# EAGLE design LED_board (EAGLE 9.6.2)
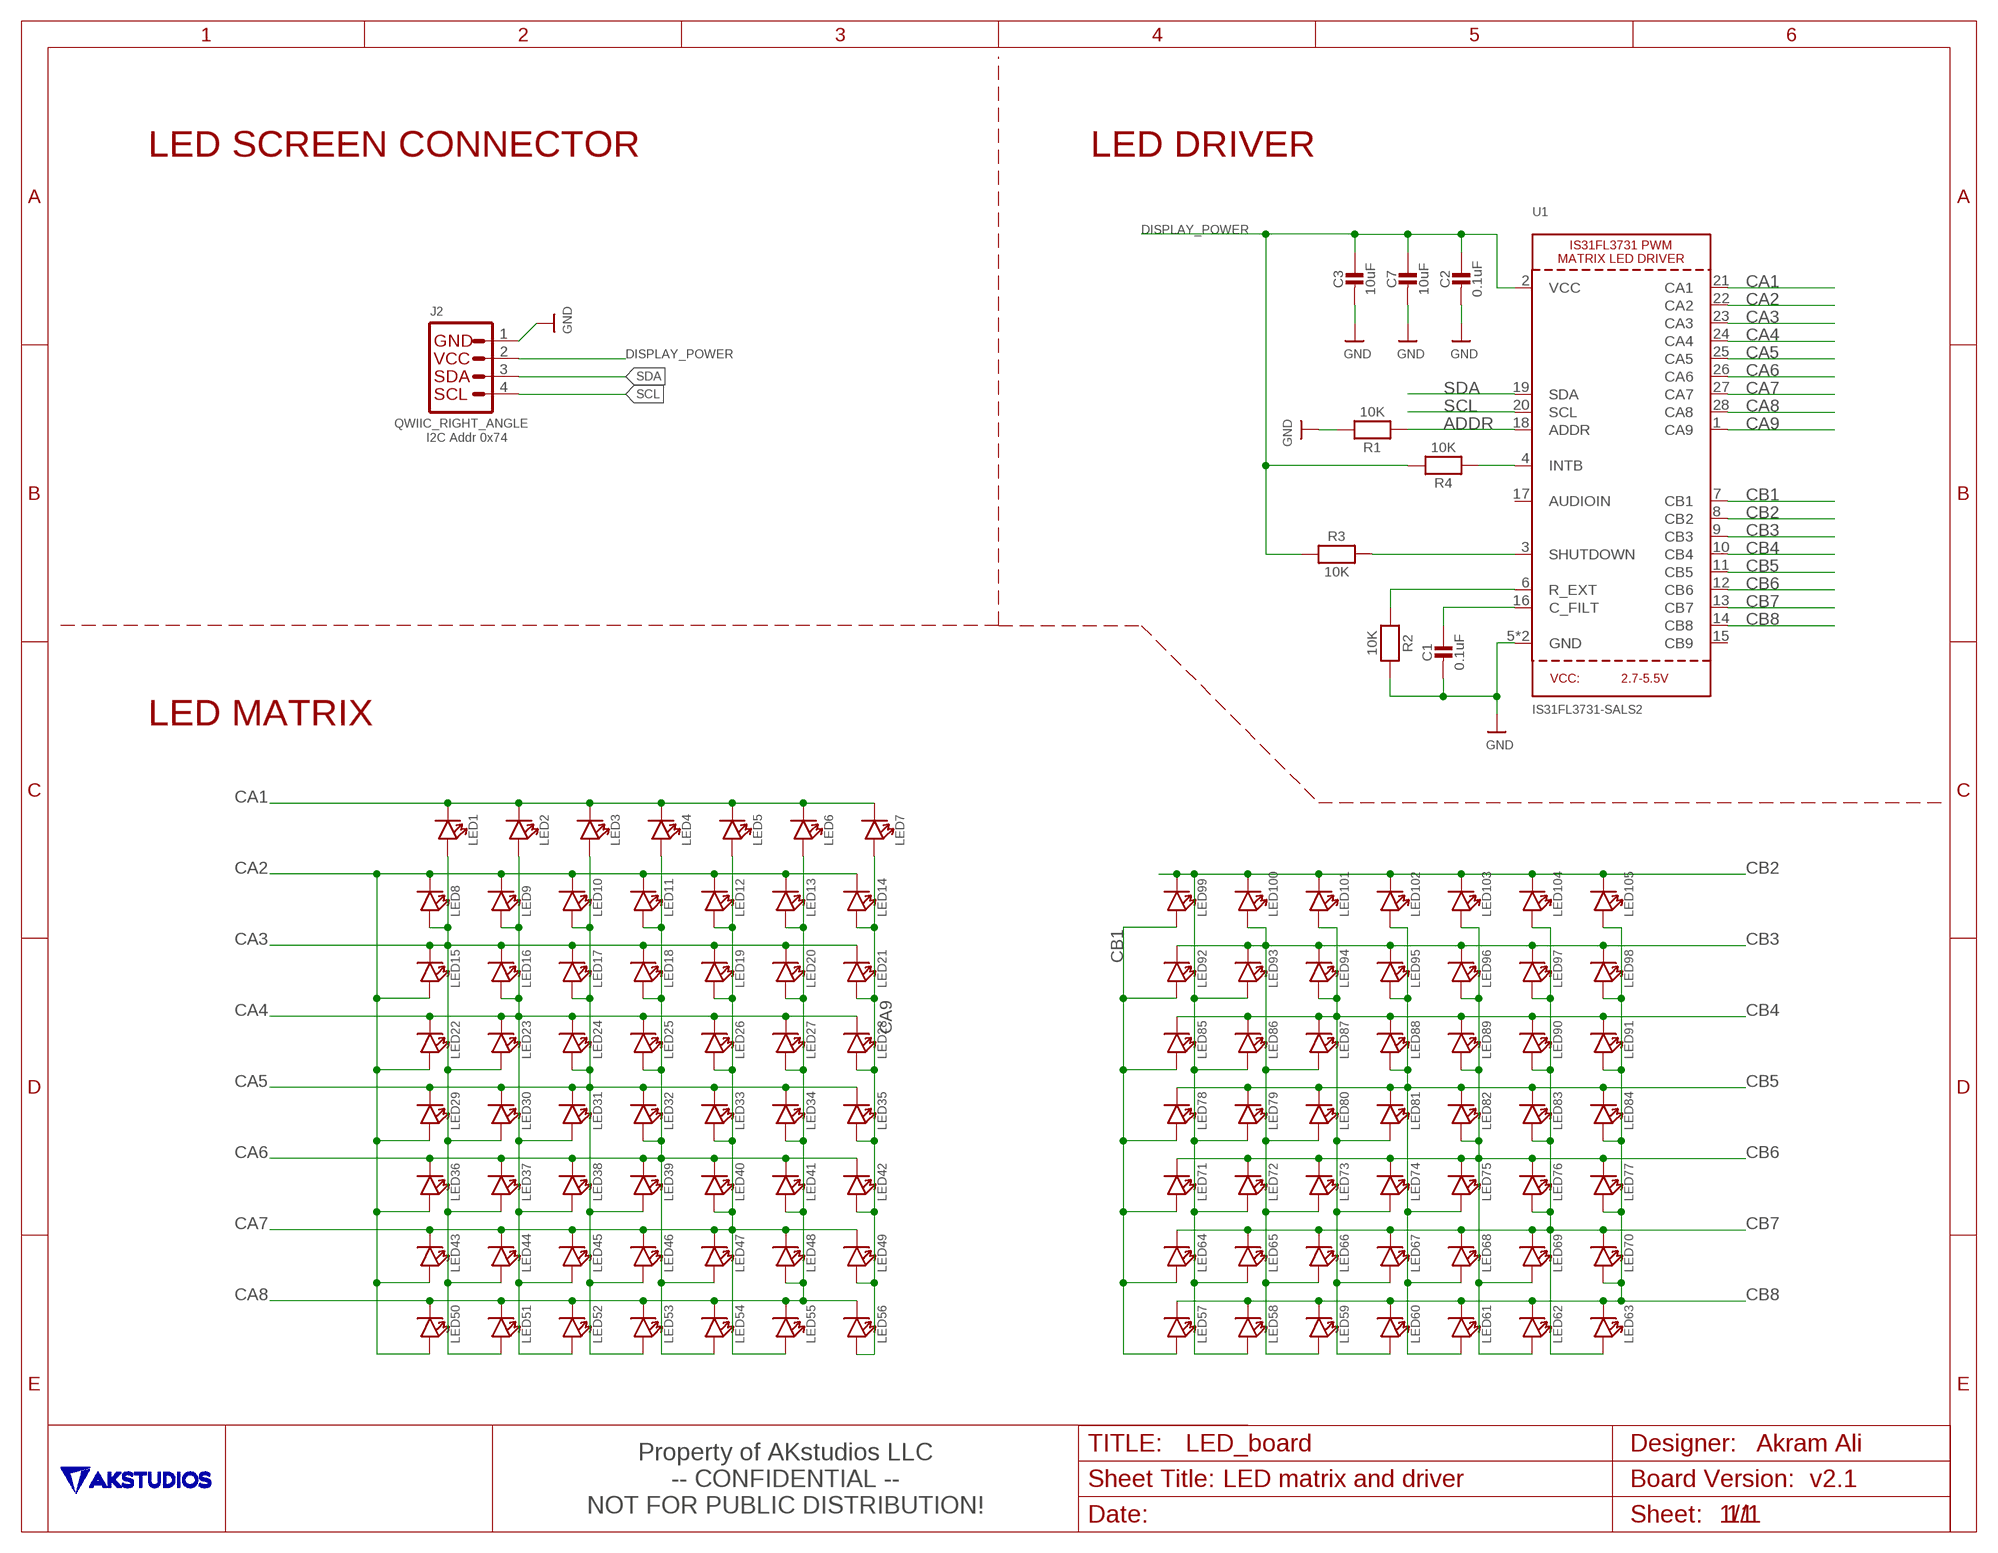
[diagram p0: schematic, sheet 1]

## Parts
C1  0.1uF  MICROBUILDER_CAP_CERAMIC_0402MP  [MICROBUILDER__0402MP]
C2  0.1uF  MICROBUILDER_CAP_CERAMIC_0402MP  [MICROBUILDER__0402MP]
C3  10uF  MICROBUILDER_CAP_CERAMIC_0402MP  [MICROBUILDER__0402MP]
C7  10uF  MICROBUILDER_CAP_CERAMIC_0402MP  [MICROBUILDER__0402MP]
J2  QWIIC_RIGHT_ANGLE  QWIIC_CONNECTORJS-1MM  [JST04_1MM_RA]
LED1  SMD-LED-CLEAR-BLUE(0402)  [LED-0402]
LED2  SMD-LED-CLEAR-BLUE(0402)  [LED-0402]
LED3  SMD-LED-CLEAR-BLUE(0402)  [LED-0402]
LED4  SMD-LED-CLEAR-BLUE(0402)  [LED-0402]
LED5  SMD-LED-CLEAR-BLUE(0402)  [LED-0402]
LED6  SMD-LED-CLEAR-BLUE(0402)  [LED-0402]
LED7  SMD-LED-CLEAR-BLUE(0402)  [LED-0402]
LED8  SMD-LED-CLEAR-BLUE(0402)  [LED-0402]
LED9  SMD-LED-CLEAR-BLUE(0402)  [LED-0402]
LED10  SMD-LED-CLEAR-BLUE(0402)  [LED-0402]
LED11  SMD-LED-CLEAR-BLUE(0402)  [LED-0402]
LED12  SMD-LED-CLEAR-BLUE(0402)  [LED-0402]
LED13  SMD-LED-CLEAR-BLUE(0402)  [LED-0402]
LED14  SMD-LED-CLEAR-BLUE(0402)  [LED-0402]
LED15  SMD-LED-CLEAR-BLUE(0402)  [LED-0402]
LED16  SMD-LED-CLEAR-BLUE(0402)  [LED-0402]
LED17  SMD-LED-CLEAR-BLUE(0402)  [LED-0402]
LED18  SMD-LED-CLEAR-BLUE(0402)  [LED-0402]
LED19  SMD-LED-CLEAR-BLUE(0402)  [LED-0402]
LED20  SMD-LED-CLEAR-BLUE(0402)  [LED-0402]
LED21  SMD-LED-CLEAR-BLUE(0402)  [LED-0402]
LED22  SMD-LED-CLEAR-BLUE(0402)  [LED-0402]
LED23  SMD-LED-CLEAR-BLUE(0402)  [LED-0402]
LED24  SMD-LED-CLEAR-BLUE(0402)  [LED-0402]
LED25  SMD-LED-CLEAR-BLUE(0402)  [LED-0402]
LED26  SMD-LED-CLEAR-BLUE(0402)  [LED-0402]
LED27  SMD-LED-CLEAR-BLUE(0402)  [LED-0402]
LED28  SMD-LED-CLEAR-BLUE(0402)  [LED-0402]
LED29  SMD-LED-CLEAR-BLUE(0402)  [LED-0402]
LED30  SMD-LED-CLEAR-BLUE(0402)  [LED-0402]
LED31  SMD-LED-CLEAR-BLUE(0402)  [LED-0402]
LED32  SMD-LED-CLEAR-BLUE(0402)  [LED-0402]
LED33  SMD-LED-CLEAR-BLUE(0402)  [LED-0402]
LED34  SMD-LED-CLEAR-BLUE(0402)  [LED-0402]
LED35  SMD-LED-CLEAR-BLUE(0402)  [LED-0402]
LED36  SMD-LED-CLEAR-BLUE(0402)  [LED-0402]
LED37  SMD-LED-CLEAR-BLUE(0402)  [LED-0402]
LED38  SMD-LED-CLEAR-BLUE(0402)  [LED-0402]
LED39  SMD-LED-CLEAR-BLUE(0402)  [LED-0402]
LED40  SMD-LED-CLEAR-BLUE(0402)  [LED-0402]
LED41  SMD-LED-CLEAR-BLUE(0402)  [LED-0402]
LED42  SMD-LED-CLEAR-BLUE(0402)  [LED-0402]
LED43  SMD-LED-CLEAR-BLUE(0402)  [LED-0402]
LED44  SMD-LED-CLEAR-BLUE(0402)  [LED-0402]
LED45  SMD-LED-CLEAR-BLUE(0402)  [LED-0402]
LED46  SMD-LED-CLEAR-BLUE(0402)  [LED-0402]
LED47  SMD-LED-CLEAR-BLUE(0402)  [LED-0402]
LED48  SMD-LED-CLEAR-BLUE(0402)  [LED-0402]
LED49  SMD-LED-CLEAR-BLUE(0402)  [LED-0402]
LED50  SMD-LED-CLEAR-BLUE(0402)  [LED-0402]
LED51  SMD-LED-CLEAR-BLUE(0402)  [LED-0402]
LED52  SMD-LED-CLEAR-BLUE(0402)  [LED-0402]
LED53  SMD-LED-CLEAR-BLUE(0402)  [LED-0402]
LED54  SMD-LED-CLEAR-BLUE(0402)  [LED-0402]
LED55  SMD-LED-CLEAR-BLUE(0402)  [LED-0402]
LED56  SMD-LED-CLEAR-BLUE(0402)  [LED-0402]
LED57  SMD-LED-CLEAR-BLUE(0402)  [LED-0402]
LED58  SMD-LED-CLEAR-BLUE(0402)  [LED-0402]
LED59  SMD-LED-CLEAR-BLUE(0402)  [LED-0402]
LED60  SMD-LED-CLEAR-BLUE(0402)  [LED-0402]
LED61  SMD-LED-CLEAR-BLUE(0402)  [LED-0402]
LED62  SMD-LED-CLEAR-BLUE(0402)  [LED-0402]
LED63  SMD-LED-CLEAR-BLUE(0402)  [LED-0402]
LED64  SMD-LED-CLEAR-BLUE(0402)  [LED-0402]
LED65  SMD-LED-CLEAR-BLUE(0402)  [LED-0402]
LED66  SMD-LED-CLEAR-BLUE(0402)  [LED-0402]
LED67  SMD-LED-CLEAR-BLUE(0402)  [LED-0402]
LED68  SMD-LED-CLEAR-BLUE(0402)  [LED-0402]
LED69  SMD-LED-CLEAR-BLUE(0402)  [LED-0402]
LED70  SMD-LED-CLEAR-BLUE(0402)  [LED-0402]
LED71  SMD-LED-CLEAR-BLUE(0402)  [LED-0402]
LED72  SMD-LED-CLEAR-BLUE(0402)  [LED-0402]
LED73  SMD-LED-CLEAR-BLUE(0402)  [LED-0402]
LED74  SMD-LED-CLEAR-BLUE(0402)  [LED-0402]
LED75  SMD-LED-CLEAR-BLUE(0402)  [LED-0402]
LED76  SMD-LED-CLEAR-BLUE(0402)  [LED-0402]
LED77  SMD-LED-CLEAR-BLUE(0402)  [LED-0402]
LED78  SMD-LED-CLEAR-BLUE(0402)  [LED-0402]
LED79  SMD-LED-CLEAR-BLUE(0402)  [LED-0402]
LED80  SMD-LED-CLEAR-BLUE(0402)  [LED-0402]
LED81  SMD-LED-CLEAR-BLUE(0402)  [LED-0402]
LED82  SMD-LED-CLEAR-BLUE(0402)  [LED-0402]
LED83  SMD-LED-CLEAR-BLUE(0402)  [LED-0402]
LED84  SMD-LED-CLEAR-BLUE(0402)  [LED-0402]
LED85  SMD-LED-CLEAR-BLUE(0402)  [LED-0402]
LED86  SMD-LED-CLEAR-BLUE(0402)  [LED-0402]
LED87  SMD-LED-CLEAR-BLUE(0402)  [LED-0402]
LED88  SMD-LED-CLEAR-BLUE(0402)  [LED-0402]
LED89  SMD-LED-CLEAR-BLUE(0402)  [LED-0402]
LED90  SMD-LED-CLEAR-BLUE(0402)  [LED-0402]
LED91  SMD-LED-CLEAR-BLUE(0402)  [LED-0402]
LED92  SMD-LED-CLEAR-BLUE(0402)  [LED-0402]
LED93  SMD-LED-CLEAR-BLUE(0402)  [LED-0402]
LED94  SMD-LED-CLEAR-BLUE(0402)  [LED-0402]
LED95  SMD-LED-CLEAR-BLUE(0402)  [LED-0402]
LED96  SMD-LED-CLEAR-BLUE(0402)  [LED-0402]
LED97  SMD-LED-CLEAR-BLUE(0402)  [LED-0402]
LED98  SMD-LED-CLEAR-BLUE(0402)  [LED-0402]
LED99  SMD-LED-CLEAR-BLUE(0402)  [LED-0402]
LED100  SMD-LED-CLEAR-BLUE(0402)  [LED-0402]
LED101  SMD-LED-CLEAR-BLUE(0402)  [LED-0402]
LED102  SMD-LED-CLEAR-BLUE(0402)  [LED-0402]
LED103  SMD-LED-CLEAR-BLUE(0402)  [LED-0402]
LED104  SMD-LED-CLEAR-BLUE(0402)  [LED-0402]
LED105  SMD-LED-CLEAR-BLUE(0402)  [LED-0402]
R1  10K  MICROBUILDER_RESISTOR_0402MP  [MICROBUILDER__0402MP]
R2  10K  MICROBUILDER_RESISTOR_0402MP  [MICROBUILDER__0402MP]
R3  10K  MICROBUILDER_RESISTOR_0402MP  [MICROBUILDER__0402MP]
R4  10K  MICROBUILDER_RESISTOR_0402MP  [MICROBUILDER__0402MP]
U1  IS31FL3731-SALS2  IS31FL3731QFN  [QFN28_4MM_0.4MM]

## Nets
ADDR: R1.1 U1.18(ADDR)
CA1: LED1.- LED2.- LED3.- LED4.- LED5.- LED6.- LED7.- U1.21(CA1)
CA2: LED8.- LED9.- LED10.- LED11.- LED12.- LED13.- LED14.- LED15.+ LED22.+ LED29.+ LED36.+ LED43.+ LED50.+ U1.22(CA2)
CA3: LED1.+ LED8.+ LED15.- LED16.- LED17.- LED18.- LED19.- LED20.- LED21.- LED23.+ LED30.+ LED37.+ LED44.+ LED51.+ U1.23(CA3)
CA4: LED2.+ LED9.+ LED16.+ LED22.- LED23.- LED24.- LED25.- LED26.- LED27.- LED28.- LED31.+ LED38.+ LED45.+ LED52.+ U1.24(CA4)
CA5: LED3.+ LED10.+ LED17.+ LED24.+ LED29.- LED30.- LED31.- LED32.- LED33.- LED34.- LED35.- LED39.+ LED46.+ LED53.+ U1.25(CA5)
CA6: LED4.+ LED11.+ LED18.+ LED25.+ LED32.+ LED36.- LED37.- LED38.- LED39.- LED40.- LED41.- LED42.- LED47.+ LED54.+ U1.26(CA6)
CA7: LED5.+ LED12.+ LED19.+ LED26.+ LED33.+ LED40.+ LED43.- LED44.- LED45.- LED46.- LED47.- LED48.- LED49.- LED55.+ U1.27(CA7)
CA8: LED6.+ LED13.+ LED20.+ LED27.+ LED34.+ LED41.+ LED48.+ LED50.- LED51.- LED52.- LED53.- LED54.- LED55.- LED56.- U1.28(CA8)
CA9: LED7.+ LED14.+ LED21.+ LED28.+ LED35.+ LED42.+ LED49.+ LED56.+ U1.1(CA9)
CB1: LED57.+ LED64.+ LED71.+ LED78.+ LED85.+ LED92.+ LED99.+ U1.7(CB1)
CB2: LED58.+ LED65.+ LED72.+ LED79.+ LED86.+ LED93.+ LED99.- LED100.- LED101.- LED102.- LED103.- LED104.- LED105.- U1.8(CB2)
CB3: LED59.+ LED66.+ LED73.+ LED80.+ LED87.+ LED92.- LED93.- LED94.- LED95.- LED96.- LED97.- LED98.- LED100.+ U1.9(CB3)
CB4: LED60.+ LED67.+ LED74.+ LED81.+ LED85.- LED86.- LED87.- LED88.- LED89.- LED90.- LED91.- LED94.+ LED101.+ U1.10(CB4)
CB5: LED61.+ LED68.+ LED75.+ LED78.- LED79.- LED80.- LED81.- LED82.- LED83.- LED84.- LED88.+ LED95.+ LED102.+ U1.11(CB5)
CB6: LED62.+ LED69.+ LED71.- LED72.- LED73.- LED74.- LED75.- LED76.- LED77.- LED82.+ LED89.+ LED96.+ LED103.+ U1.12(CB6)
CB7: LED63.+ LED64.- LED65.- LED66.- LED67.- LED68.- LED69.- LED70.- LED76.+ LED83.+ LED90.+ LED97.+ LED104.+ U1.13(CB7)
CB8: LED57.- LED58.- LED59.- LED60.- LED61.- LED62.- LED63.- LED70.+ LED77.+ LED84.+ LED91.+ LED98.+ LED105.+ U1.14(CB8)
DISPLAY_POWER: C2.1 C3.1 C7.1 J2.2 R3.1 R4.2 U1.2(VCC)
GND: C1.2 C2.2 C3.2 C7.2 J2.1 R1.2 R2.2 U1.5(GND) U1.THERMAL(GND)
N$1: R3.2 U1.3(SHUTDOWN)
N$2: C1.1 U1.16(C_FILT)
N$3: R4.1 U1.4(INTB)
R_EXT: R2.1 U1.6(R_EXT)
SCL: J2.4 U1.20(SCL)
SDA: J2.3 U1.19(SDA)
Unconnected: U1.15(CB9) U1.17(AUDIOIN)

## Notes on the sheet
- LED SCREEN CONNECTOR | LED DRIVER
- I2C Addr 0x74
- LED MATRIX
- Akram Ali
- Property of AKstudios LLC
- v2.1
- -- CONFIDENTIAL --
  NOT FOR PUBLIC DISTRIBUTION!

## Library data of the parts
C1-C3 C7 = Adafruit Feather 32u4 Bluefruit LE:MICROBUILDER_CAP_CERAMIC: Ceramic Capacitors For new designs, use the packages preceded by an '_' character since they are more reliable: The following footprints should be used on most boards: _0402 - Standard footprint for regular board layouts _0603 - Standard footprint for regular board layouts _0805 - Standard footprint for regular board layouts _1206 - Standard footprint for regular board layouts For extremely tight-pitch boards where space is at a premium, the following 'micro-pitch' footprints can be used (smaller pads, no silkscreen outline, etc.): _0402MP - Micro-pitch footprint for very dense/compact boards _0603MP - Micro-pitch footprint for very dense/compact boards _0805MP - Micro-pitch footprint for very dense/compact boards _1206MP - Micro-pitch footprint for very dense/compact boards; MPN: GRM155R71C104KA88J
J2 = SparkFun-Connectors:QWIIC_CONNECTOR: SparkFun I2C Standard Qwiic Connector An SMD 1mm pitch JST connector makes it easy and quick (get it? Qwiic?) to connect I2C devices to each other. The Qwiic system <http://www.sparkfun.com/qwiic> enables fast and solderless connection between popular platforms and various sensors and actuators. We carry 200mm <https://www.sparkfun.com/products/14204>, 100mm <https://www.sparkfun.com/products/14205>, 50mm <https://www.sparkfun.com/products/14206>, and breadboard friendly <https://www.sparkfun.com/products/14207> Qwiic cables. We also offer 10 pcs strips <https://www.sparkfun.com/products/14323> the SMD connectors.; MPN: SM04B-SRSS-TB(LF)(SN); PROD_ID: CONN-13694
LED1-LED105 = Seeed-LED:SMD-LED-CLEAR-BLUE(0402): 304090075; MPN: IN-S42ATUW; VALUE: BLUE-0402
R1-R4 = Adafruit Feather 32u4 Bluefruit LE:MICROBUILDER_RESISTOR: Resistors For new designs, use the packages preceded by an '_' character since they are more reliable: The following footprints should be used on most boards: _0402 - Standard footprint for regular board layouts _0603 - Standard footprint for regular board layouts _0805 - Standard footprint for regular board layouts _1206 - Standard footprint for regular board layouts For extremely tight-pitch boards where space is at a premium, the following 'micro-pitch' footprints can be used (smaller pads, no silkscreen outline, etc.): _0402MP - Micro-pitch footprint for very dense/compact boards _0603MP - Micro-pitch footprint for very dense/compact boards _0805MP - Micro-pitch footprint for very dense/compact boards _1206MP - Micro-pitch footprint for very dense/compact boards; MPN: RC0402FR-7W10KL
U1 = microbuilder:IS31FL3731: IS31FL3731 PWM LED Matrix Driver

## Net classes
1 power: width 0.127 mm, clearance 0.127 mm

## Board
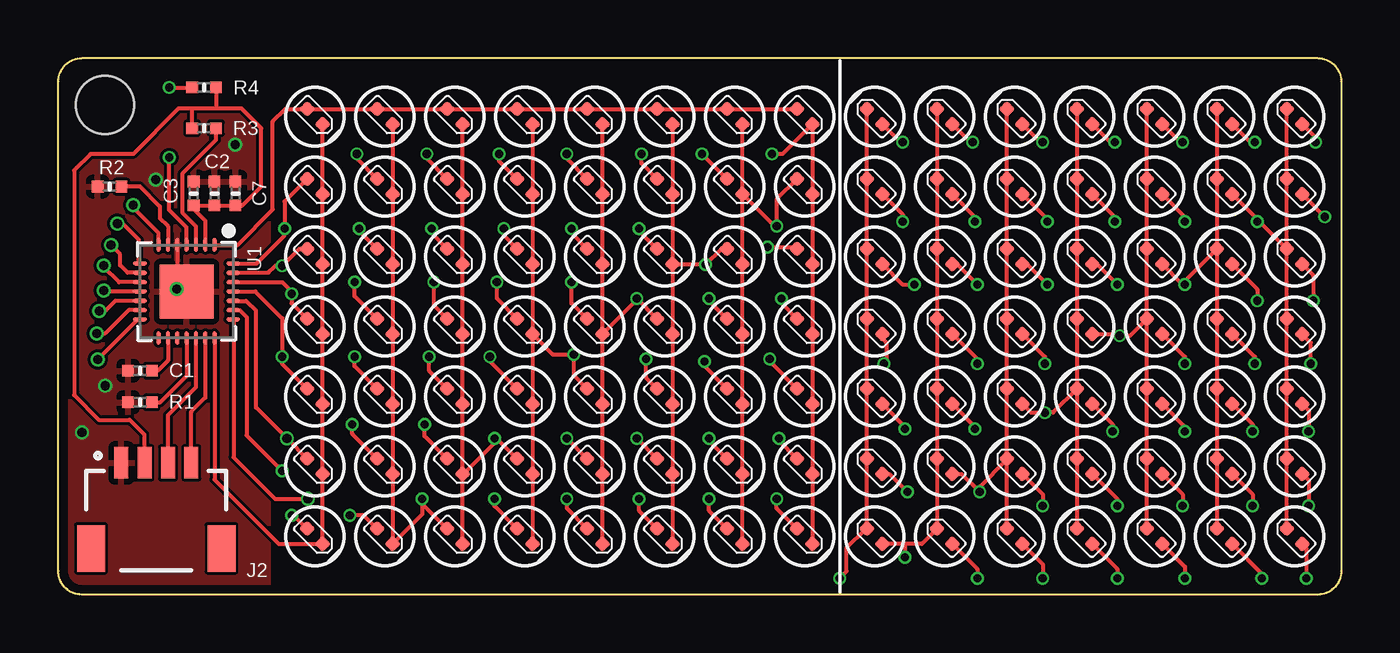
[diagram p1: board, top side]
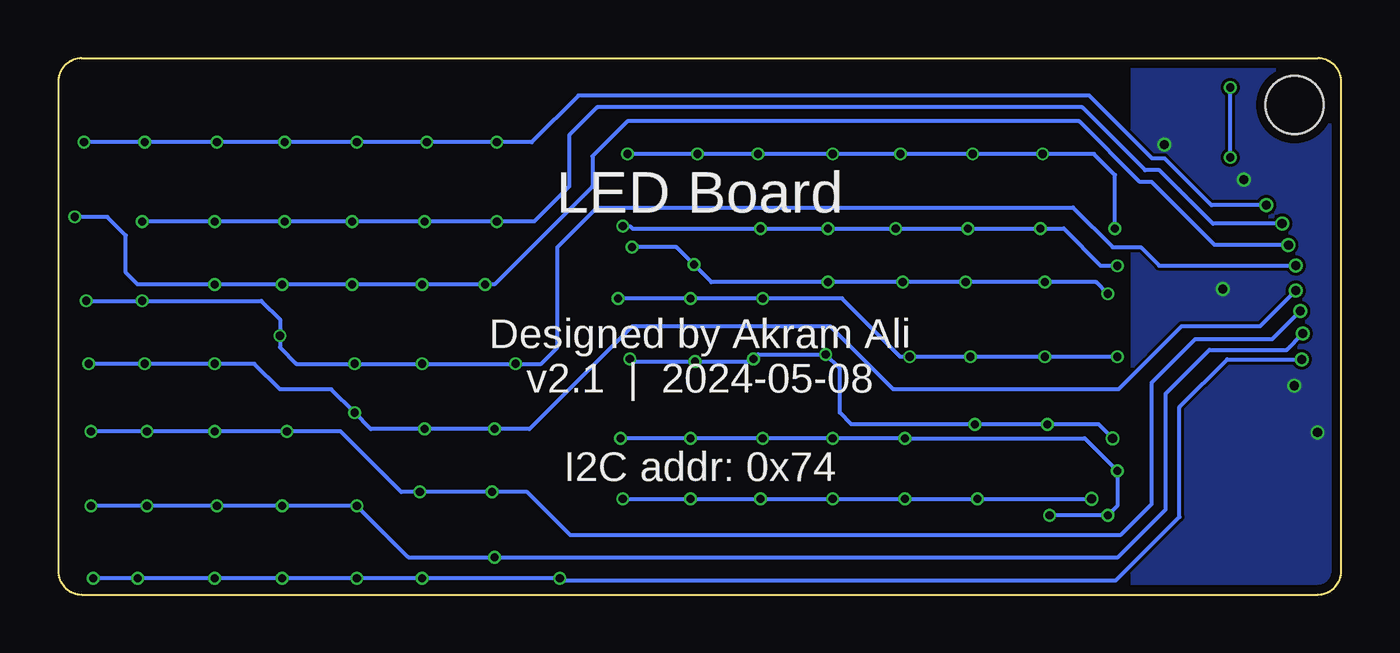
[diagram p2: board, bottom side, seen from below]

Size 55 x 23 mm. Coordinates in mm from the lower left corner, seen from the top.
Outline: 54,0 1,0 arc-90 0,1 0,22 arc-90 1,23 54,23 arc-90 55,22 55,1 arc-90 54,0
Copper layers (1*2*15*16): Top 0.035559375mm / dielectric 0.17018125mm / Route2 0.01778125mm / dielectric 47mil / Route15 0.01778125mm / dielectric 0.17018125mm / Bottom 0.035559375mm
Design rules "oshpark-4layer *": minimum track width 5mil, minimum drill 10mil, track to track 5mil, track to pad 5mil, pad to pad 5mil, via to via 5mil, smd to smd 5mil, copper to edge 15mil, drill to drill 6mil, minimum pad ring 4mil, minimum via ring 4mil, stop-mask expansion 1.5mil, vias tented up to drill 10mil, thermal gap 10mil
Holes 2.5 mm at 2,21

### Footprints (pad centres in the part's own frame; a part is rotated, then mirrored left to right if it is on the bottom)
MICROBUILDER__0402MP = smd 0.5 x 0.5: 1 -0.508,0; 2 0.508,0
JST04_1MM_RA = smd 0.6 x 1.35: 1 -1.5,0; 2 -0.5,0; 3 0.5,0; 4 1.5,0 | smd 1.2 x 2: NC1 2.8,-3.675; NC2 -2.8,-3.675
LED-0402 = smd 0.5 x 0.5: + -0.463,0; - 0.463,0
QFN28_4MM_0.4MM = smd 0.6 x 0.18: 1 -2,1.2; 2 -2,0.8; 3 -2,0.4; 4 -2,0; 5 -2,-0.4; 6 -2,-0.8; 7 -2,-1.2; 15 2,-1.2; 16 2,-0.8; 17 2,-0.4; 18 2,0; 19 2,0.4; 20 2,0.8; 21 2,1.2 | smd 0.18 x 0.6: 8 -1.2,-2; 9 -0.8,-2; 10 -0.4,-2; 11 0,-2; 12 0.4,-2; 13 0.8,-2; 14 1.2,-2; 22 1.2,2; 23 0.8,2; 24 0.4,2; 25 0,2; 26 -0.4,2; 27 -0.8,2; 28 -1.2,2 | smd 2.3 x 2.3: THERMAL 0,0

### Placement (x,y rotation side)
C1  3.5,9.6 180 top
C2  6.7,17.2 90 top
C3  5.8,17.2 90 top
C7  7.6,17.2 90 top
J2  4.2,5.65 0 top
LED1  11,2.5 315 top
LED2  11,5.5 315 top
LED3  11,8.5 315 top
LED4  11,11.5 315 top
LED5  11,14.5 315 top
LED6  11,17.5 315 top
LED7  11,20.5 315 top
LED8  14,2.5 315 top
LED9  14,5.5 315 top
LED10  14,8.5 315 top
LED11  14,11.5 315 top
LED12  14,14.5 315 top
LED13  14,17.5 315 top
LED14  14,20.5 315 top
LED15  17,2.5 315 top
LED16  17,5.5 315 top
LED17  17,8.5 315 top
LED18  17,11.5 315 top
LED19  17,14.5 315 top
LED20  17,17.5 315 top
LED21  17,20.5 315 top
LED22  20,2.5 315 top
LED23  20,5.5 315 top
LED24  20,8.5 315 top
LED25  20,11.5 315 top
LED26  20,14.5 315 top
LED27  20,17.5 315 top
LED28  20,20.5 315 top
LED29  23,2.5 315 top
LED30  23,5.5 315 top
LED31  23,8.5 315 top
LED32  23,11.5 315 top
LED33  23,14.5 315 top
LED34  23,17.5 315 top
LED35  23,20.5 315 top
LED36  26,2.5 315 top
LED37  26,5.5 315 top
LED38  26,8.5 315 top
LED39  26,11.5 315 top
LED40  26,14.5 315 top
LED41  26,17.5 315 top
LED42  26,20.5 315 top
LED43  29,2.5 315 top
LED44  29,5.5 315 top
LED45  29,8.5 315 top
LED46  29,11.5 315 top
LED47  29,14.5 315 top
LED48  29,17.5 315 top
LED49  29,20.5 315 top
LED50  32,2.5 315 top
LED51  32,5.5 315 top
LED52  32,8.5 315 top
LED53  32,11.5 315 top
LED54  32,14.5 315 top
LED55  32,17.5 315 top
LED56  32,20.5 315 top
LED57  35,20.5 135 top
LED58  35,17.5 135 top
LED59  35,14.5 135 top
LED60  35,11.5 135 top
LED61  35,8.5 135 top
LED62  35,5.5 135 top
LED63  35,2.5 135 top
LED64  38,20.5 135 top
LED65  38,17.5 135 top
LED66  38,14.5 135 top
LED67  38,11.5 135 top
LED68  38,8.5 135 top
LED69  38,5.5 135 top
LED70  38,2.5 135 top
LED71  41,20.5 135 top
LED72  41,17.5 135 top
LED73  41,14.5 135 top
LED74  41,11.5 135 top
LED75  41,8.5 135 top
LED76  41,5.5 135 top
LED77  41,2.5 135 top
LED78  44,20.5 135 top
LED79  44,17.5 135 top
LED80  44,14.5 135 top
LED81  44,11.5 135 top
LED82  44,8.5 135 top
LED83  44,5.5 135 top
LED84  44,2.5 135 top
LED85  47,20.5 135 top
LED86  47,17.5 135 top
LED87  47,14.5 135 top
LED88  47,11.5 135 top
LED89  47,8.5 135 top
LED90  47,5.5 135 top
LED91  47,2.5 135 top
LED92  50,20.5 135 top
LED93  50,17.5 135 top
LED94  50,14.5 135 top
LED95  50,11.5 135 top
LED96  50,8.5 135 top
LED97  50,5.5 135 top
LED98  50,2.5 135 top
LED99  53,20.5 135 top
LED100  53,17.5 135 top
LED101  53,14.5 135 top
LED102  53,11.5 135 top
LED103  53,8.5 135 top
LED104  53,5.5 135 top
LED105  53,2.5 135 top
R1  3.5,8.25 180 top
R2  2.2,17.5 180 top
R3  6.25,20 0 top
R4  6.25,21.75 0 top
U1  5.5,13 270 top

### Tracks (layer width: path | path; a pad name or v marks a point on that pad's centre or on a via)
ADDR
  Top 0.178: R1.1 4.38,8.25 5.5,9.37 U1.18
CA1
  Top 0.178: U1.21 6.7,4.93 9.45,2.17 LED1.- LED2.- LED3.- LED4.- LED5.- LED6.- LED7.-
CA2  (via drill 0.35, 0.39)
  Top 0.178: U1.22 7.51,11.79 7.51,5.89 9.3,4.1 v10.7,4.1 | LED14.- LED13.- LED12.- LED11.- LED10.- LED9.- LED8.- 15.6,3.45 v15.6,4.1 15.6,3.9 LED15.+ | LED22.+ 18.7,3.8 v18.7,4.1 | LED29.+ 21.8,3.7 v21.8,4.1 | LED36.+ 24.9,3.6 v24.9,4.1 | LED43.+ 27.9,3.6 v27.9,4.1 | LED50.+ 30.8,3.7 v30.8,4.1
  Bottom 0.178: v30.8,4.1 v27.9,4.1 v24.9,4.1 v21.8,4.1 v18.7,4.1 v15.6,4.1 v10.7,4.1
CA3  (via drill 0.35)
  Top 0.178: U1.23 7.78,12.2 8.07,11.91 8.07,6.83 v9.6,5.3 | LED15.- LED16.- | LED16.- LED17.- LED18.- LED19.- LED20.- LED21.- | LED8.+ 13.1,3.4 v12.5,3.4 | LED1.+ 10.1,3.4 v10,3.4 | LED44.+ 27.9,6.6 v27.9,6.7 | LED37.+ v24.8,6.7 | LED30.+ v21.8,6.7 | LED23.+ 18.8,6.7 v18.7,6.7 18.7,6.5 17.37,5.17 LED16.- | LED51.+ 30.89,6.61 v30.89,6.7
  Bottom 0.178: v30.89,6.7 v27.9,6.7 v24.8,6.7 v21.8,6.7 v18.7,6.7 11,6.7 v9.6,5.3 9.6,3.8 v10,3.4 v12.5,3.4
CA4  (via drill 0.35, 0.39)
  Top 0.178: U1.24 8.05,12.6 8.47,12.18 8.47,8.03 v9.8,6.7 LED2.+ | LED28.- LED27.- LED26.- LED25.- | LED25.- LED24.- LED23.- LED22.- | LED2.+ | LED9.+ 12.6,6.9 v12.6,7.3 | LED16.+ 15.7,6.8 v15.7,7.3 | LED52.+ 30.5,10 v30.5,10.1 | LED45.+ 27.7,9.8 v27.7,10 | LED38.+ 25.2,9.3 v25.2,10.1 | LED31.+ 22.1,9.4 v22.1,10.3 21.2,10.3 LED25.-
  Bottom 0.178: v9.8,6.7 10.4,7.3 v12.6,7.3 v15.7,7.3 21,7.3 21.5,7.8 21.5,9.7 v22.1,10.3 25,10.3 v25.2,10.1 25.3,10 v27.7,10 30.4,10 v30.5,10.1
CA5  (via drill 0.35)
  Top 0.178: U1.25 8.45,13 9.6,11.85 v9.6,10.2 9.6,9.9 LED3.+ | LED29.- LED30.- LED31.- LED32.- | LED32.- LED33.- LED34.- LED35.- | LED39.+ v24.8,12.7 | v24.8,12.7 | LED32.- 24.8,12.65 v24.8,12.7 | LED46.+ 27.9,12.6 v27.9,12.7 | LED53.+ 31,12.5 v31,12.7 | LED24.+ 18.5,10 v18.5,10.2 | LED17.+ 15.9,9.6 v15.9,10.2 | LED10.+ 12.7,9.8 v12.7,10.2
  Bottom 0.178: v9.6,10.2 v12.7,10.2 v15.9,10.2 v18.5,10.2 18.9,10.2 21.4,12.7 v24.8,12.7 v27.9,12.7 v31,12.7
CA6  (via drill 0.35)
  Top 0.178: U1.26 9.6,13.4 10,13 v10,12.9 10,12.5 LED4.+ | LED42.- LED41.- LED40.- | LED40.- LED39.- LED38.- LED37.- LED36.- | v30.4,14.9 31.6,14.9 LED54.+ | LED47.+ 28.43,14.83 v27.75,14.15 27.73,14.17 LED40.- | LED11.+ 12.7,12.8 v12.7,13.4 | LED18.+ 16.1,12.4 v16.1,13.4 | LED25.+ 18.8,12.7 v18.8,13.4 | LED32.+ 22,12.5 v22,13.4
  Bottom 0.178: v10,12.9 10.5,13.4 v12.7,13.4 v16.1,13.4 v18.8,13.4 v22,13.4 27,13.4 v27.75,14.15 28.5,14.9 v30.4,14.9
CA7  (via drill 0.35)
  Top 0.178: U1.27 9,13.8 9.3,14.1 v9.6,14.1 10.33,14.83 LED5.+ | LED43.- LED44.- LED45.- LED46.- LED47.- LED48.- | LED48.- LED49.- | LED55.+ 30.8,16.95 v30.8,15.8 30.7,15.8 LED48.- | LED12.+ 12.9,15.6 v12.9,15.7 | LED19.+ 16,15.5 v16,15.7 | LED26.+ 19.1,15.4 v19.1,15.7 | LED33.+ 22,15.5 v22,15.7 | LED40.+ 24.9,15.6 v24.9,15.7
  Bottom 0.178: v9.6,14.1 10.3,14.1 11.9,15.7 v12.9,15.7 v16,15.7 v19.1,15.7 v22,15.7 v24.9,15.7 30.4,15.7 30.5,15.8 v30.8,15.8
CA8  (via drill 0.35)
  Top 0.178: LED50.- LED51.- LED52.- LED53.- LED54.- LED55.- LED56.- 31.05,18.9 v30.6,18.9 | U1.28 8.5,14.2 9.7,15.4 v9.7,15.7 9.7,16.85 LED6.+ | LED48.+ v27.6,18.9 | v27.6,18.9 | LED41.+ 25,18.5 v25,18.9 | LED34.+ 21.8,18.7 v21.8,18.9 | LED27.+ 18.9,18.6 v18.9,18.9 | LED20.+ 15.8,18.7 v15.8,18.9 | LED13.+ 12.8,18.7 v12.8,18.9
  Bottom 0.178: v9.7,15.7 9.7,18 10.6,18.9 v12.8,18.9 v15.8,18.9 v18.9,18.9 v21.8,18.9 v25,18.9 v27.6,18.9 v30.6,18.9
CA9
  Top 0.178: U1.1 7.69,15 9.2,16.51 9.2,20.3 9.73,20.83 LED7.+ LED14.+ LED21.+ LED28.+ LED35.+ LED42.+ LED49.+ LED56.+
CB1  (via drill 0.35, 0.39)
  Top 0.178: U1.7 4.3,15.5 3.21,16.59 v3.21,16.7 | LED99.+ 53.9,19.6 v53.9,19.4 | LED92.+ 51.1,19.4 v51.3,19.4 | LED85.+ 48.1,19.4 v48.2,19.4 | LED78.+ 45.1,19.4 v45.3,19.4 | LED71.+ 42.1,19.4 v42.2,19.4 | LED64.+ 39.1,19.4 v39.2,19.4 | LED57.+ 36.1,19.4 v36.2,19.4
  Bottom 0.178: v3.21,16.7 5.56,16.7 7.56,18.7 8.1,18.7 10.8,21.4 32.7,21.4 34.7,19.4 v36.2,19.4 v39.2,19.4 v42.2,19.4 v45.3,19.4 v48.2,19.4 v51.3,19.4 v53.9,19.4
CB2  (via drill 0.35, 0.39)
  Top 0.178: v2.53,15.91 2.76,15.91 3.45,15.22 3.45,14.25 U1.8 | LED105.- LED104.- LED103.- LED102.- LED101.- | LED101.- LED100.- LED99.- | LED58.+ 36.2,16.3 v36.2,16 | LED65.+ 39.3,16.2 v39.3,16 | LED72.+ 42.4,16.1 v42.4,16 | LED79.+ 45.3,16.2 v45.3,16 | LED86.+ 48.3,16.2 v48.3,16 | LED93.+ 51.4,16.1 v51.4,16 51.5,16 LED101.-
  Bottom 0.178: v2.53,15.91 v2.54,15.9 5.5,15.9 7.79,18.2 8.4,18.2 11.1,20.9 31.9,20.9 33.1,19.7 33.1,17.5 34.6,16 v36.2,16 v39.3,16 v42.4,16 v45.3,16 v48.3,16 v51.4,16
CB3  (via drill 0.35, 0.39)
  Top 0.178: v2.26,14.99 2.65,14.6 2.65,14.12 2.97,13.8 U1.9 | LED92.- LED93.- LED94.- | LED94.- LED95.- LED96.- LED97.- LED98.- | LED87.+ 48.2,13.3 v48.3,13.3 48.3,13.45 LED94.- | LED80.+ 44.53,14.17 v45.4,13.3 | LED73.+ 41.53,14.17 v42.4,13.3 | LED66.+ 38.53,14.17 v39.4,13.3 | LED59.+ 36.2,13.3 v36.7,13.3 | LED100.+ v54.3,16.2 | v54.3,16.2
  Bottom 0.178: v2.26,14.99 5.42,14.99 8.12,17.7 8.63,17.7 11.23,20.3 30.6,20.3 32.1,18.8 32.1,17.5 36.3,13.3 v36.7,13.3 v39.4,13.3 v42.4,13.3 v45.4,13.3 v48.3,13.3 51.6,13.3 52.1,13.8 52.1,15.4 52.9,16.2 v54.3,16.2
CB4  (via drill 0.35, 0.39)
  Top 0.178: v1.95,14.11 1.95,14.05 2.6,13.4 U1.10 | LED91.- LED90.- LED89.- LED88.- | LED88.- LED87.- LED86.- LED85.- | LED101.+ 53.8,13.7 v53.8,12.6 | LED94.+ 51.4,13.1 v51.4,12.6 | LED60.+ 35.33,10.97 35.5,10.8 35.5,10 v35.4,9.9 | LED67.+ 39.4,10.1 v39.4,9.9 | LED74.+ 42.3,10.2 v42.3,9.9 | LED81.+ 45.43,11.17 v45.5,11.1 45.95,11.1 LED88.-
  Bottom 0.178: v53.8,12.6 v51.4,12.6 46.3,12.6 45.5,11.8 v45.5,11.1 45.5,10.6 44.8,9.9 v42.3,9.9 v39.4,9.9 v35.4,9.9 34.3,9.9 33.6,10.6 33.6,14.9 31.9,16.6 11.5,16.6 9.8,14.9 8.6,14.9 7.8,14.11 v1.95,14.11
CB5  (via drill 0.35, 0.39)
  Top 0.178: U1.11 1.99,13 v1.95,13.04 | LED78.- LED79.- LED80.- LED81.- LED82.- | LED82.- LED83.- LED84.- | v53.7,9.9 53.7,10.8 LED102.+ | LED95.+ 51.3,10.2 v51.3,9.9 | LED88.+ 48.3,10.2 v48.3,9.9 | LED61.+ 36.3,7.2 v36.3,7.1 | LED68.+ 39.3,7.2 v39.3,7.1 | LED75.+ 41.7,7.8 v42.3,7.8 42.65,7.8 LED82.-
  Bottom 0.178: v1.95,13.04 3.49,11.5 6.85,11.5 9.55,8.8 19.2,8.8 21.9,11.5 30.4,11.5 34.8,7.1 v36.3,7.1 v39.3,7.1 41.6,7.1 v42.3,7.8 43.3,8.8 45.5,8.8 46.6,9.9 v48.3,9.9 v51.3,9.9 v53.7,9.9
CB6  (via drill 0.35, 0.39)
  Top 0.178: v1.75,12.15 2,12.15 2.45,12.6 U1.12 | LED77.- 40.67,5.8 | 40.67,5.8 LED76.- LED75.- LED74.- LED73.- LED72.- LED71.- | LED103.+ 53.6,7.9 v53.6,7 | LED96.+ 51.2,7.3 v51.2,7 | LED89.+ 48.3,7.2 v48.3,7 | LED82.+ 45.2,7.3 v45.2,7 | LED62.+ 35.63,5.17 v36.4,4.4 | LED69.+ 38.73,5.17 v39.5,4.4 39.5,4.63 40.67,5.8
  Bottom 0.178: v1.75,12.15 2.95,10.95 6.26,10.95 8.14,9.07 8.14,3.87 9.47,2.54 33.04,2.54 34.9,4.4 v36.4,4.4 v39.5,4.4 40.3,4.4 42.9,7 v45.2,7 v48.3,7 v51.2,7 v53.6,7
CB7  (via drill 0.35, 0.39)
  Top 0.178: v1.64,11.2 2.01,11.2 3.01,12.2 U1.13 | LED64.- LED65.- LED66.- LED67.- LED68.- LED69.- LED70.- 37.02,2.17 36.3,2.17 | LED76.+ 42.2,4.3 v42.2,3.8 | LED83.+ 45.4,4.1 v45.4,3.8 | LED90.+ 48.2,4.3 v48.2,3.8 | LED97.+ 51.2,4.3 v51.2,3.8 | LED104.+ 53.6,4.9 v53.6,3.8 | 36.3,2.17 LED63.+ | 36.3,2.17 v36.3,1.6
  Bottom 0.178: v1.64,11.2 2.34,10.5 5.65,10.5 7.54,8.61 7.54,3.63 9.57,1.6 v36.3,1.6 40,1.6 v42.2,3.8 v45.4,3.8 v48.2,3.8 v51.2,3.8 v53.6,3.8
CB8  (via drill 0.35, 0.39)
  Top 0.178: U1.14 3.4,11.8 v1.68,10.09 | v33.5,0.7 33.8,1 33.8,2 34.63,2.83 LED63.- LED62.- LED61.- LED60.- LED59.- LED58.- LED57.- | LED105.+ 53.5,2 v53.5,0.7 | LED98.+ 51.6,0.9 v51.6,0.7 | LED91.+ 48.3,1.2 v48.3,0.7 | LED84.+ 45.4,1.1 v45.4,0.7 | LED77.+ 42.2,1.3 v42.2,0.7 | LED70.+ 39.4,1.1 v39.4,0.7
  Bottom 0.178: v1.68,10.09 4.88,10.09 6.93,8.04 6.93,3.33 9.66,0.6 33.4,0.6 v33.5,0.7 v39.4,0.7 v42.2,0.7 v45.4,0.7 v48.3,0.7 v51.6,0.7 v53.5,0.7
DISPLAY_POWER
  Top 0.178: 5.75,20.85 5.15,20.85 3.2,18.9 1.38,18.9 0.68,18.2 0.68,8.55 1.73,7.5 3.05,7.5 3.7,6.85 J2.2 | 5.75,20.85 6.75,20.85 | 6.75,20.85 7.85,20.85 8.7,20 8.7,17.5 7.89,16.69 C7.1 C2.1 C3.1 5.8,16.54 6.3,16.04 U1.2 | R3.1 5.74,20.84 5.75,20.85 | R4.2 6.76,20.86 6.75,20.85
GND  (via drill 0.39)
  Top 0.178: v5.07,13.1 5.05,13.12 5.1,13.16 U1.5
  other vias: 4.17,17.8 7.58,19.3 2.02,8.96 1.01,6.96
  pour Top: -0.3,23.36 -0.3,-0.3 9.01,-0.3 9.01,23.36
  pour Bottom: -0.1,23.16 -0.1,-0.1 8.94,-0.1 8.94,23.16
N$1
  Top 0.178: U1.3 5.9,15.79 5.33,16.35 5.33,18.08 6.76,19.51 R3.2
N$2
  Top 0.178: U1.16 4.7,10.04 4.26,9.6 C1.1
N$3  (via drill 0.35)
  Top 0.178: U1.4 5.5,15.75 4.75,16.5 v4.75,18.75 | v4.75,21.75 R4.1
  Bottom 0.178: v4.75,18.75 v4.75,21.75
R_EXT
  Top 0.178: R2.1 3.5,17.5 4.35,16.65 4.35,16.15 4.7,15.8 U1.6
SCL
  Top 0.178: U1.20 6.3,8.45 5.7,7.85 J2.4
SDA
  Top 0.178: U1.19 5.9,8.9 4.7,7.7 J2.3

### Text on the board
bPlace: LED Board | Designed by Akram Ali / v2.1 | 2024-05-08 | I2C addr: 0x74